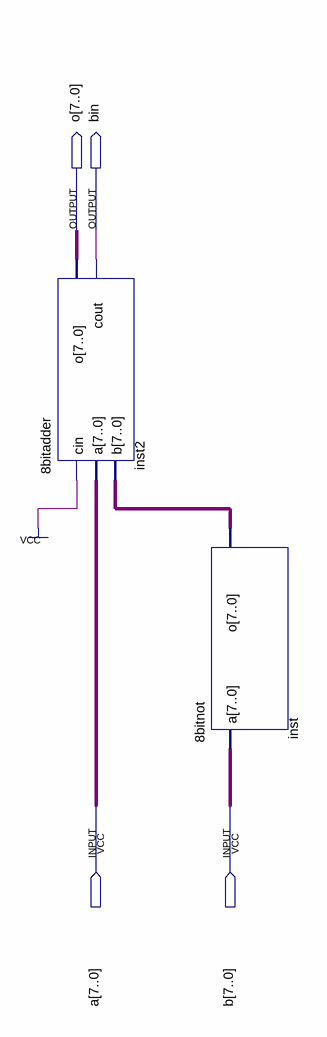
[diagram p0: schematic sheet]
// Quartus schematic 8bitsubtractor.bdf as structural Verilog: 2 symbols, 4 pins
module \8bitsubtractor  (
  input  [7:0] a,
  input  [7:0] b,
  output [7:0] o,
  output bin
);

  wire [7:0] inst_o;

  \8bitadder  inst2 (.cin(1'b1), .a(a), .b(inst_o), .o(o), .cout(bin));
  \8bitnot  inst (.a(b), .o(inst_o));
endmodule
